# Altium schematic sheet PAGE12.SchDoc
size 246 x 182 mm
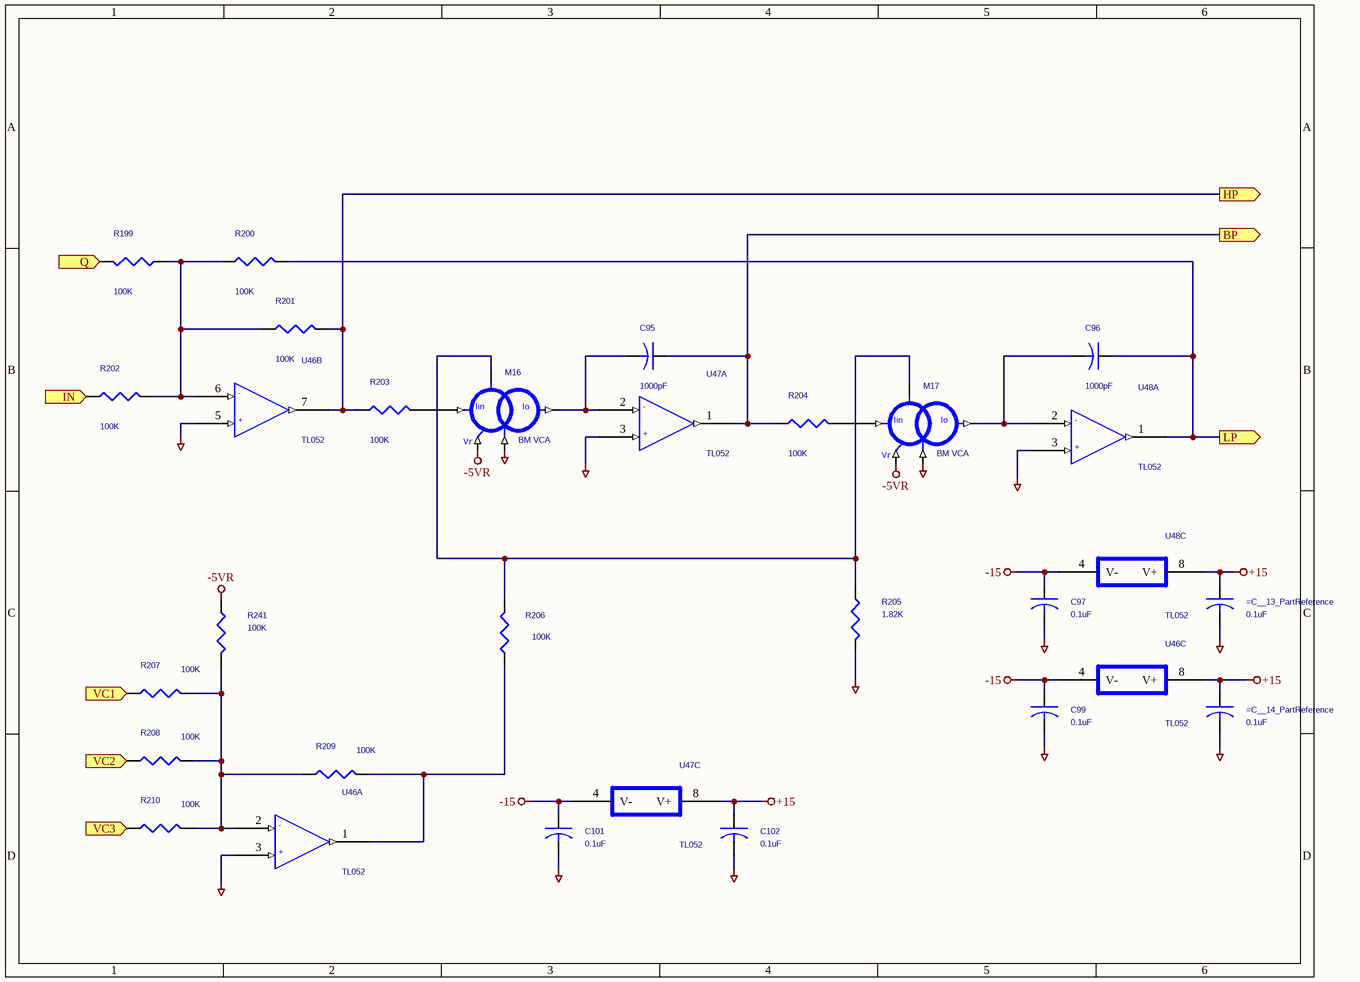
[diagram p0: PAGE12.SchDoc]

## Parts
=C__13_PartReference  0.1uF  [AXIALCAP0.3]
=C__14_PartReference  0.1uF  [AXIALCAP0.3]
C95  1000pF  [AXIAL0.5X0.2]
C96  1000pF  [AXIAL0.5X0.2]
C97  0.1uF  [AXIALCAP0.3]
C99  0.1uF  [AXIALCAP0.3]
C101  0.1uF  [AXIALCAP0.3]
C102  0.1uF  [AXIALCAP0.3]
M16  BM VCA
M17  BM VCA
R199  100K  [AXIAL0.4]
R200  100K  [AXIAL0.4]
R201  100K  [AXIAL0.4]
R202  100K  [AXIAL0.4]
R203  100K  [AXIAL0.4]
R204  100K  [AXIAL0.4]
R205  1.82K  [AXIAL0.4]
R206  100K  [AXIAL0.4]
R207  100K  [AXIAL0.4]
R208  100K  [AXIAL0.4]
R209  100K  [AXIAL0.4]
R210  100K  [AXIAL0.4]
R241  100K  [AXIAL0.4]
U46  TL052  [DIP8]  (parts A,B,C of 3)
U47  TL052  [DIP8]  (parts A,C of 3)
U48  TL052  [DIP8]  (parts A,C of 3)

## Ports
BP (out), HP (out), IN (in), LP (out), Q (in), VC1 (in), VC2 (in), VC3 (in)

## Nets
+15: =C__13_PartReference.1 =C__14_PartReference.1 C102.1 U46.8(V+) U47.8(V+) U48.8(V+)
-5VR: M16.-VR M17.-VR R241.1
-15: C97.1 C99.1 C101.1 U46.4(V-) U47.4(V-) U48.4(V-)
AGND: =C__13_PartReference.2 =C__14_PartReference.2 C97.2 C99.2 C101.2 C102.2 M16.CVP M17.CVP R205.2 U46.3(+) U46.5(+) U47.3(+) U48.3(+)
BP: C95.1 R204.1 U47.1(OUT) ; port BP
HP: R201.2 R203.1 U46.7(OUT) ; port HP
IN: R202.1 ; port IN
LP: C96.1 R200.2 U48.1(OUT) ; port LP
Q: R199.2 ; port Q
VC1: R207.1 ; port VC1
VC2: R208.1 ; port VC2
VC3: R210.1 ; port VC3
NetC95_2: C95.2 M16.Io U47.2(-)
NetC96_2: C96.2 M17.Io U48.2(-)
NetM16_CVN: M16.CVN M17.CVN R205.1 R206.2
NetM16_Iin: M16.Iin R203.2
NetM17_Iin: M17.Iin R204.2
NetR199_1: R199.1 R200.1 R201.1 R202.2 U46.6(-)
NetR206_1: R206.1 R209.2 U46.1(OUT)
NetR207_2: R207.2 R208.2 R209.1 R210.2 R241.2 U46.2(-)

## Notes on the sheet
- (in symbol BM VCA) Vr

## Library data of the parts
=C__13_PartReference =C__14_PartReference C95-C97 C99 C101 C102 = CAP_Dup1
R199-R210 R241 = R_Dup1
U46-U48 = GEN DUAL OPAMP-H
  U46: PACKAGE: VCF
  U47: PACKAGE: VCF1
  U48: PACKAGE: VCF2
M16 M17 = BM VCA
  M16: U__9_PartReference: =M16_U__9_PartReference; U__9_PACKAGE: =M16_U__9_PACKAGE; Q__7_PartReference: =M16_Q__7_PartReference; Q__4_PartReference: =M16_Q__4_PartReference; Q__5_PartReference: =M16_Q__5_PartReference; Q__6_PartReference: =M16_Q__6_PartReference; R__32_PartReference: =M16_R__32_PartReference; R__33_PartReference: =M16_R__33_PartReference; C__10_PartReference: =M16_C__10_PartReference; TitleBlock_2_Page_Number: =M16_TitleBlock_2_Page_Number; TitleBlock_2_Title: =M16_TitleBlock_2_Title
  M17: U__9_PartReference: =M17_U__9_PartReference; U__9_PACKAGE: =M17_U__9_PACKAGE; Q__7_PartReference: =M17_Q__7_PartReference; Q__4_PartReference: =M17_Q__4_PartReference; Q__5_PartReference: =M17_Q__5_PartReference; Q__6_PartReference: =M17_Q__6_PartReference; R__32_PartReference: =M17_R__32_PartReference; R__33_PartReference: =M17_R__33_PartReference; C__10_PartReference: =M17_C__10_PartReference; TitleBlock_2_Page_Number: =M17_TitleBlock_2_Page_Number; TitleBlock_2_Title: =M17_TitleBlock_2_Title